# Altium schematic sheet toplevel.SchDoc: SION Top Level Schematic
size A4; Organization: UNSW Solar Racing Team; Address3: UNSW; Address4: Sydney NSW 2052; Address2: Electrical Engineering; Address1: Rm 109
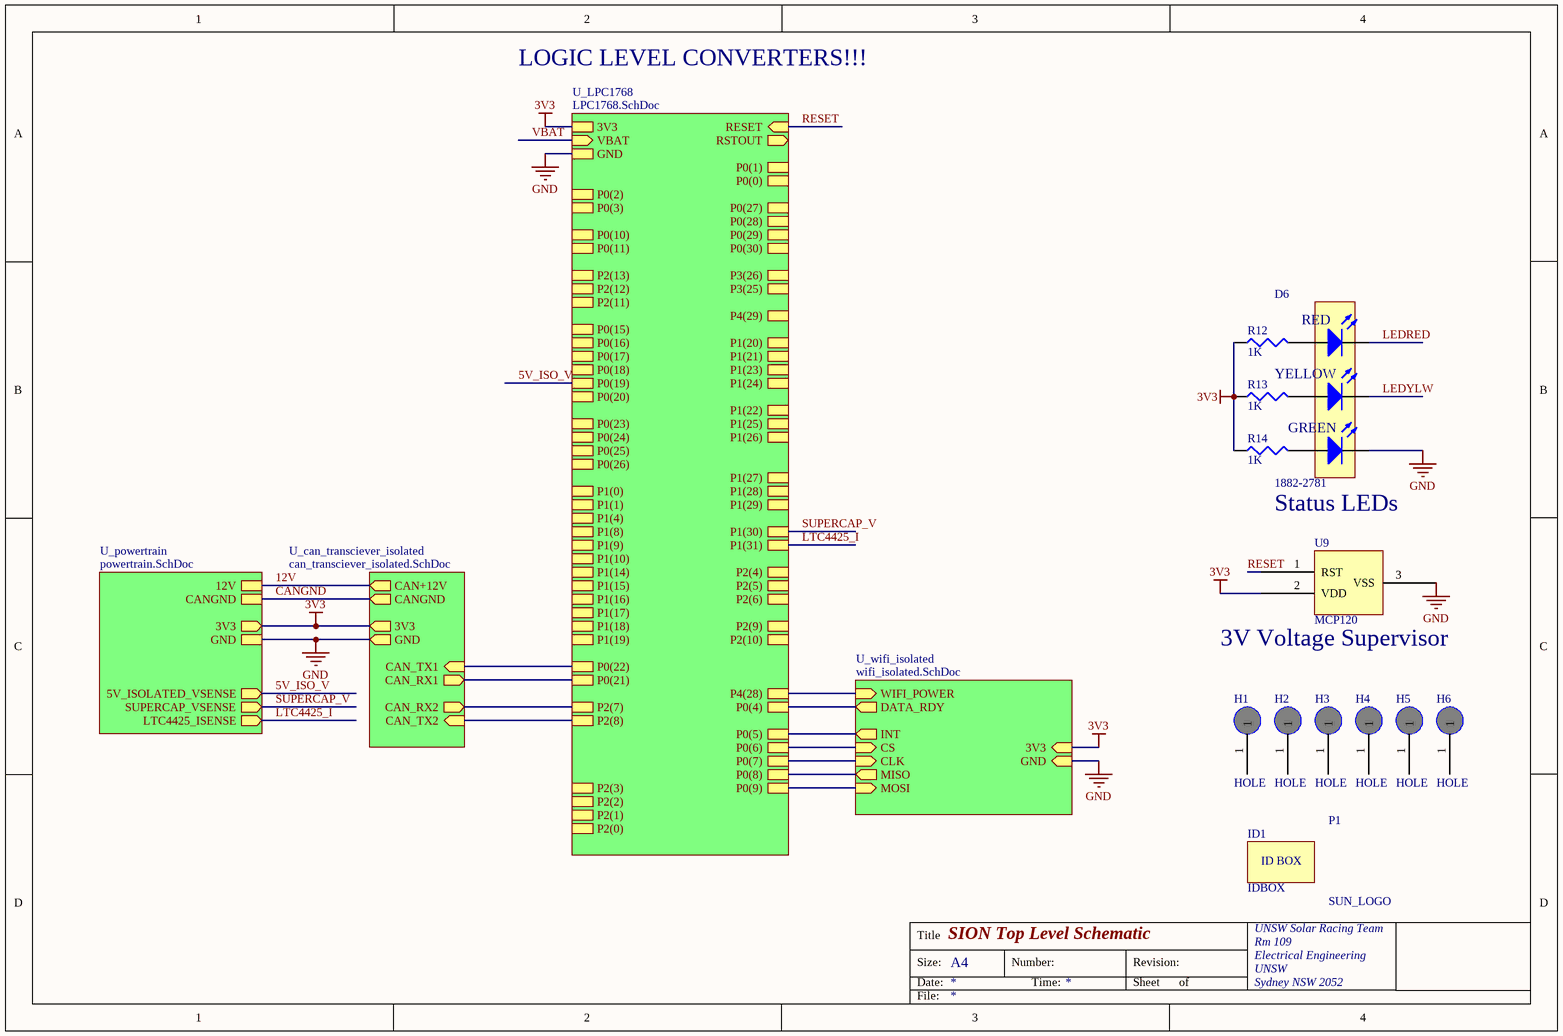
[diagram p0: toplevel.SchDoc]

## Parts
D6  1882-2781  [LED_TRILEVEL]
H1  HOLE  [#6]
H2  HOLE  [#6]
H3  HOLE  [#6]
H4  HOLE  [#6]
H5  HOLE  [#6]
H6  HOLE  [#6]
ID1  IDBOX  [IDBOX]
P1  SUN_LOGO  [SUNSWIFTLOGO]
R12  1K  [0603]
R13  1K  [0603]
R14  1K  [0603]
U9  MCP120  [SOT23-3]

## Sub-sheets
U_can_transciever_isolated = can_transciever_isolated.SchDoc: CAN+12V (out), CAN_TX1 (in), CAN_TX2 (in), CAN_RX1 (out), CAN_RX2 (out), CANGND (out), GND (out), 3V3 (out)
U_LPC1768 = LPC1768.SchDoc: P0(26), P0(25), P0(24), P0(23), P1(31), P1(30), P0(28), P0(27), P3(26), P3(25), P0(29), P0(30), P1(18), P1(19), P1(20), P1(21), P1(22), P1(24), P1(23), P1(25), P1(26), P1(27), P1(28), P1(29), P0(0), P0(1), P0(10), P0(11), P2(13), P2(12), P2(11), P2(10), P0(22), P0(21), P0(20), P0(19), P0(18), P0(17), P0(15), P0(16), P2(9), P2(8), P2(7), P2(6), P2(5), P2(4), P2(3), P2(2), P2(1), P2(0), P0(2), P0(3), P1(0), P1(1), P1(4), P1(8), P1(9), P1(10), P1(14), P1(15), P1(16), P1(17), P0(4), P0(5), P0(6), P0(7), P0(8), P0(9), P4(29), P4(28), GND, 3V3, RSTOUT (out), RESET (in), VBAT (in)
U_powertrain = powertrain.SchDoc: GND, 5V_ISOLATED_VSENSE (out), SUPERCAP_VSENSE (out), 12V, CANGND, 3V3 (out), LTC4425_ISENSE (out)
U_wifi_isolated = wifi_isolated.SchDoc: CS (in), CLK (in), MISO (out), MOSI (in), INT (out), GND (in), 3V3 (in), WIFI_POWER (in), DATA_RDY (out)

## Nets
3V3: R12.1 R13.1 R14.1 U9.2(VDD) ; sheet U_powertrain/3V3, sheet U_can_transciever_isolated/3V3, sheet U_LPC1768/3V3, sheet U_wifi_isolated/3V3
GND: D6.1(K) U9.3(VSS) ; sheet U_powertrain/GND, sheet U_can_transciever_isolated/GND, sheet U_LPC1768/GND, sheet U_wifi_isolated/GND
5V_ISO_V: sheet U_powertrain/5V_ISOLATED_VSENSE, sheet U_LPC1768/P0(19)
12V: sheet U_powertrain/12V, sheet U_can_transciever_isolated/CAN+12V
CANGND: sheet U_powertrain/CANGND, sheet U_can_transciever_isolated/CANGND
LEDRED: D6.3(K)
LEDYLW: D6.2(K)
LTC4425_I: sheet U_powertrain/LTC4425_ISENSE, sheet U_LPC1768/P1(31)
RESET: U9.1(RST) ; sheet U_LPC1768/RESET
SUPERCAP_V: sheet U_powertrain/SUPERCAP_VSENSE, sheet U_LPC1768/P1(30)
VBAT: sheet U_LPC1768/VBAT
NetD6_4: D6.4(A) R12.2
NetD6_5: D6.5(A) R13.2
NetD6_6: D6.6(A) R14.2
(unnamed): sheet U_can_transciever_isolated/CAN_TX1, sheet U_LPC1768/P0(22)
(unnamed): sheet U_can_transciever_isolated/CAN_TX2, sheet U_LPC1768/P2(8)
(unnamed): sheet U_can_transciever_isolated/CAN_RX1, sheet U_LPC1768/P0(21)
(unnamed): sheet U_can_transciever_isolated/CAN_RX2, sheet U_LPC1768/P2(7)
(unnamed): sheet U_LPC1768/P0(4), sheet U_wifi_isolated/DATA_RDY
(unnamed): sheet U_LPC1768/P0(5), sheet U_wifi_isolated/INT
(unnamed): sheet U_LPC1768/P0(6), sheet U_wifi_isolated/CS
(unnamed): sheet U_LPC1768/P0(7), sheet U_wifi_isolated/CLK
(unnamed): sheet U_LPC1768/P0(8), sheet U_wifi_isolated/MISO
(unnamed): sheet U_LPC1768/P0(9), sheet U_wifi_isolated/MOSI
(unnamed): sheet U_LPC1768/P4(28), sheet U_wifi_isolated/WIFI_POWER

Not connected (* = marked no-connect by the designer): H1 1; H2 1; H3 1; H4 1; H5 1; H6 1

## Notes on the sheet
- LOGIC LEVEL CONVERTERS!!!
- Status LEDs
- (near U9) 3V Voltage Supervisor
- Title
- Size:
- Date:
- A4
- Number:
- Time:
- Revision:
- Sheet
- of
- File:
- (in symbol IDBOX) ID BOX
- (in symbol LED-TRILEVEL) RED; YELLOW; GREEN

## Library data of the parts
D6 = LED-TRILEVEL: Three level LED; Farnell: 1461596
H1-H6 = HOLE: Order#: NA; Supplier: NA; Price: NA
R12-R14 = RES1: Resistor; Order#: 9331697; Supplier: Farnell; Price: 0.05
U9 = MCP120T: Voltage Supervisor; Farnell: 1292233; FarnellPrice: 0.951